# Altium schematic sheet Heart.SchDoc
size A3; SheetNumber: 1; SheetTotal: 1
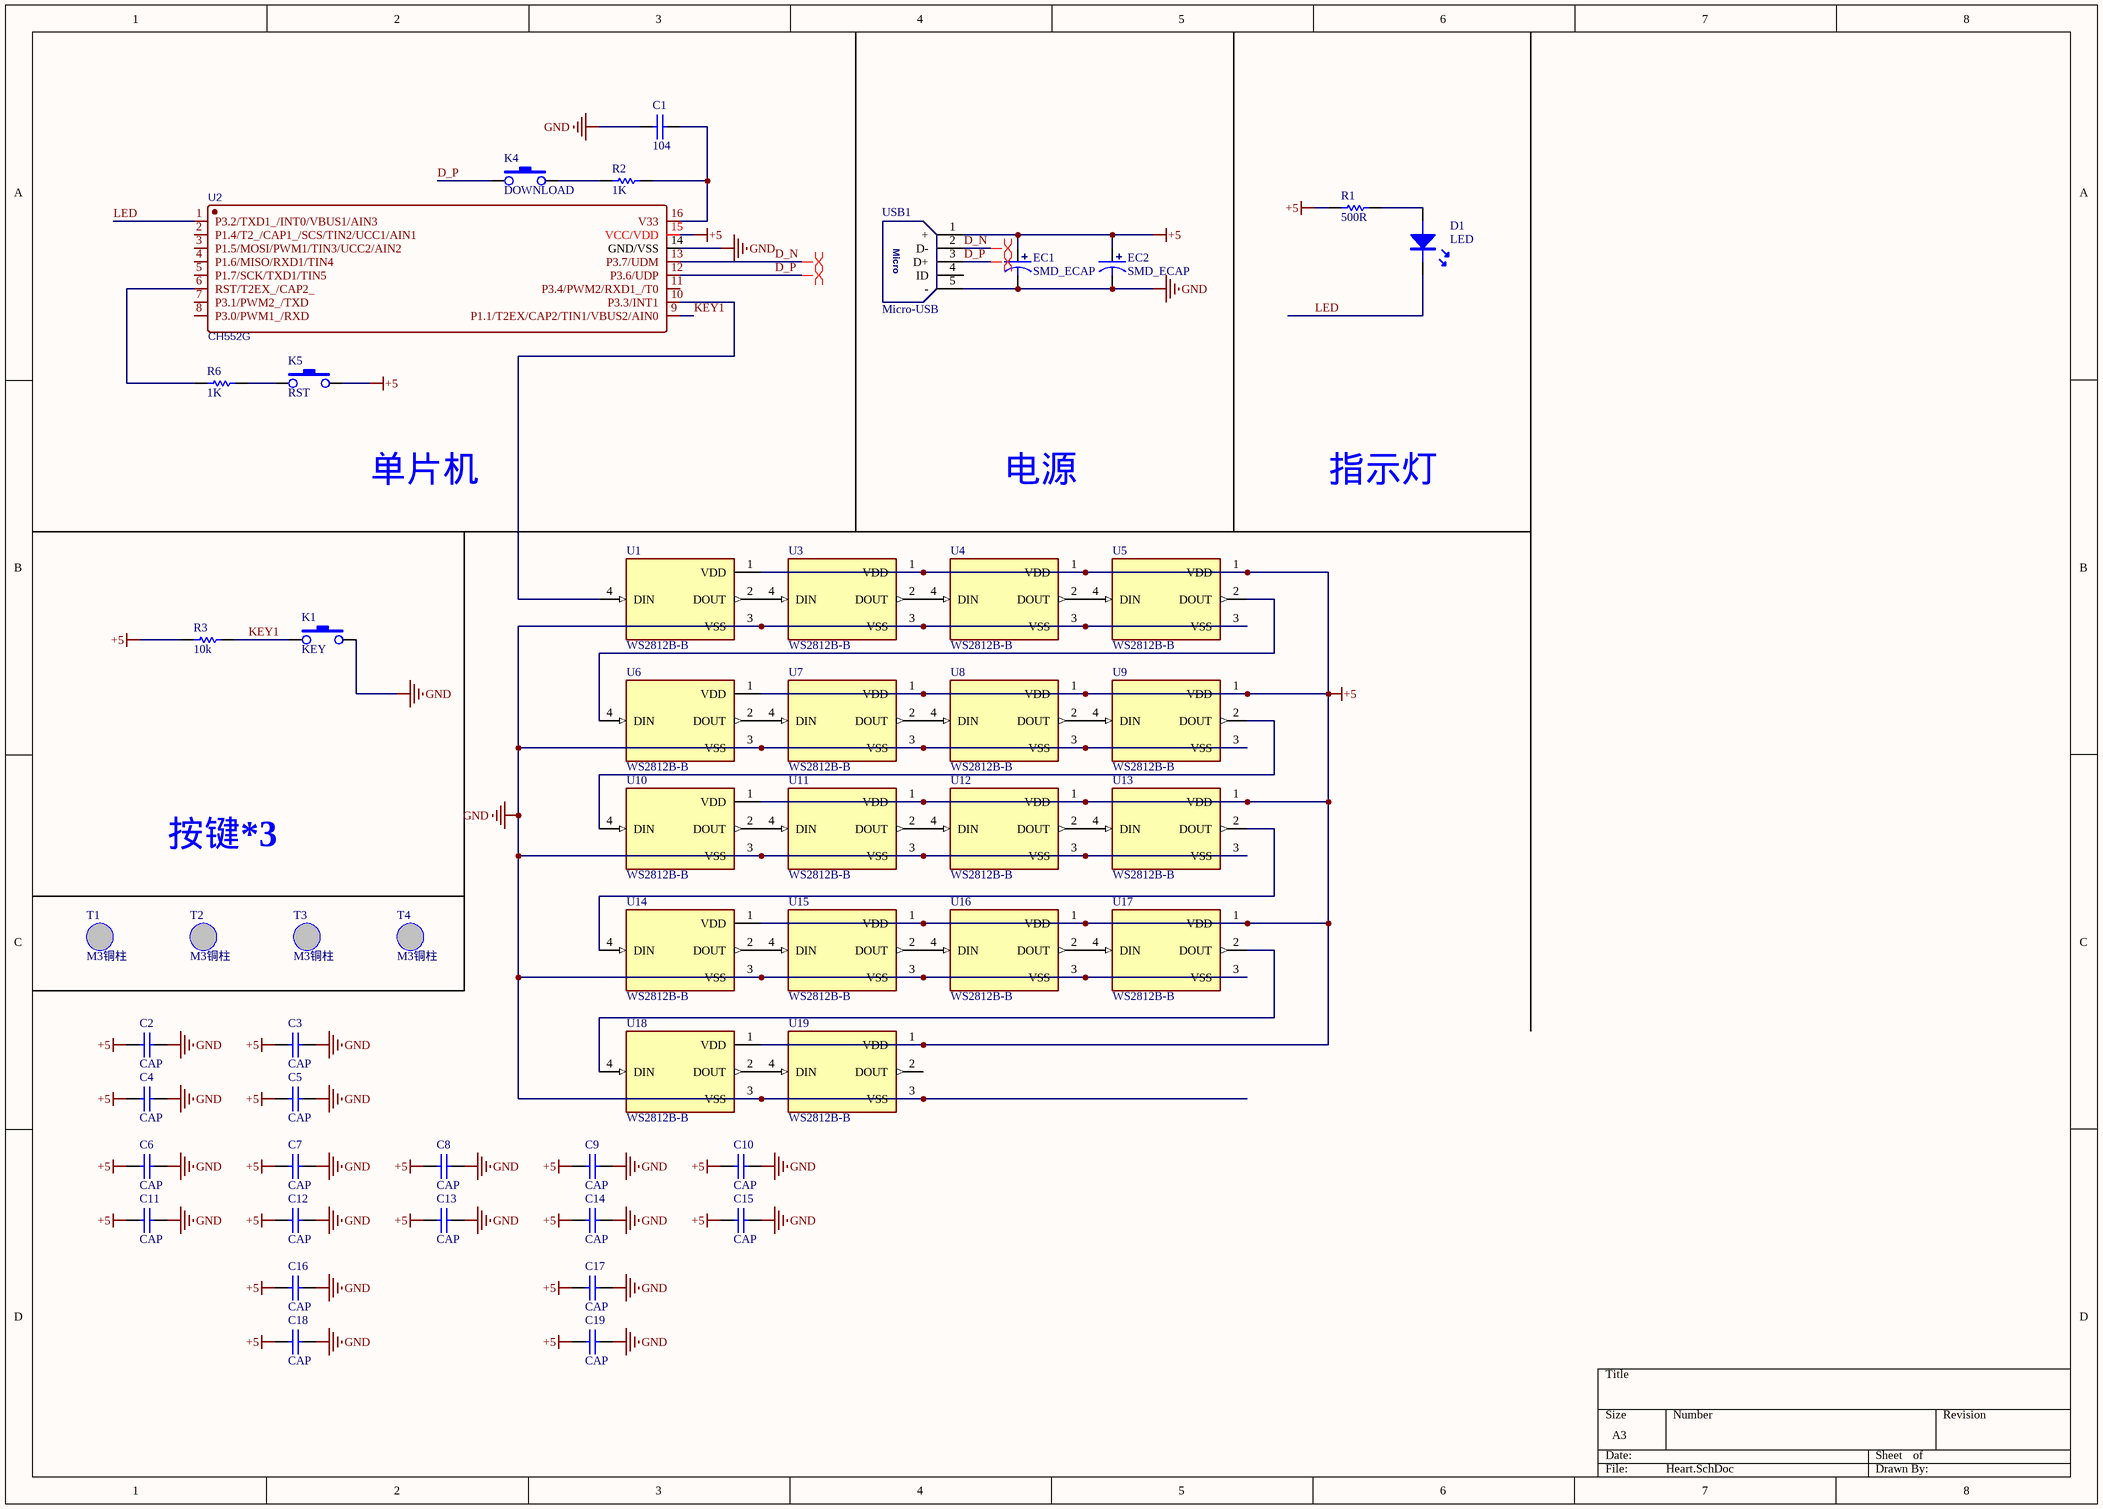
[diagram p0: Heart.SchDoc]

## Parts
C1  104  [0805C]
C2  CAP  [0805C]
C3  CAP  [0805C]
C4  CAP  [0805C]
C5  CAP  [0805C]
C6  CAP  [0805C]
C7  CAP  [0805C]
C8  CAP  [0805C]
C9  CAP  [0805C]
C10  CAP  [0805C]
C11  CAP  [0805C]
C12  CAP  [0805C]
C13  CAP  [0805C]
C14  CAP  [0805C]
C15  CAP  [0805C]
C16  CAP  [0805C]
C17  CAP  [0805C]
C18  CAP  [0805C]
C19  CAP  [0805C]
D1  LED  [LED-0805G]
EC1  SMD_ECAP  [SMD-EC5.0X5.3X5.4]
EC2  SMD_ECAP  [SMD-EC5.0X5.3X5.4]
K1  KEY  [SMD-3X6X5]
K4  DOWNLOAD  [SMD-3X6X5]
K5  RST  [SMD-3X6X5]
R1  500R  [0805R]
R2  1K  [0805R]
R3  10k  [0805R]
R6  1K  [0805R]
T1  M3铜柱  [M3 单孔]
T2  M3铜柱  [M3 单孔]
T3  M3铜柱  [M3 单孔]
T4  M3铜柱  [M3 单孔]
U1  WS2812B-B  [LED_WS2812B-B++]
U2  CH552G  [SOP16]
U3  WS2812B-B  [LED_WS2812B-B++]
U4  WS2812B-B  [LED_WS2812B-B++]
U5  WS2812B-B  [LED_WS2812B-B++]
U6  WS2812B-B  [LED_WS2812B-B++]
U7  WS2812B-B  [LED_WS2812B-B++]
U8  WS2812B-B  [LED_WS2812B-B++]
U9  WS2812B-B  [LED_WS2812B-B++]
U10  WS2812B-B  [LED_WS2812B-B++]
U11  WS2812B-B  [LED_WS2812B-B++]
U12  WS2812B-B  [LED_WS2812B-B++]
U13  WS2812B-B  [LED_WS2812B-B++]
U14  WS2812B-B  [LED_WS2812B-B++]
U15  WS2812B-B  [LED_WS2812B-B++]
U16  WS2812B-B  [LED_WS2812B-B++]
U17  WS2812B-B  [LED_WS2812B-B++]
U18  WS2812B-B  [LED_WS2812B-B++]
U19  WS2812B-B  [LED_WS2812B-B++]
USB1  Micro-USB  [USB-MICRO_A++]

## Nets
+5: C2.1 C3.1 C4.1 C5.1 C6.1 C7.1 C8.1 C9.1 C10.1 C11.1 C12.1 C13.1 C14.1 C15.1 C16.1 C17.1 C18.1 C19.1 EC1.1 EC2.1 K5.3 R1.1 R3.1 U1.1(VDD) U2.15(VCC/VDD) U3.1(VDD) U4.1(VDD) U5.1(VDD) U6.1(VDD) U7.1(VDD) U8.1(VDD) U9.1(VDD) U10.1(VDD) U11.1(VDD) U12.1(VDD) U13.1(VDD) U14.1(VDD) U15.1(VDD) U16.1(VDD) U17.1(VDD) U18.1(VDD) U19.1(VDD) USB1.1(+)
GND: C1.2 C2.2 C3.2 C4.2 C5.2 C6.2 C7.2 C8.2 C9.2 C10.2 C11.2 C12.2 C13.2 C14.2 C15.2 C16.2 C17.2 C18.2 C19.2 EC1.2 EC2.2 K1.3 U1.3(VSS) U2.14(GND/VSS) U3.3(VSS) U4.3(VSS) U5.3(VSS) U6.3(VSS) U7.3(VSS) U8.3(VSS) U9.3(VSS) U10.3(VSS) U11.3(VSS) U12.3(VSS) U13.3(VSS) U14.3(VSS) U15.3(VSS) U16.3(VSS) U17.3(VSS) U18.3(VSS) U19.3(VSS) USB1.5(-)
D_N: U2.13(P3.7/UDM) USB1.2(D-)
D_P: K4.1 U2.12(P3.6/UDP) USB1.3(D+)
KEY1: K1.1 R3.2 U2.9(P1.1/T2EX/CAP2/TIN1/VBUS2/AIN0)
LED: D1.K U2.1(P3.2/TXD1_/INT0/VBUS1/AIN3)
NetC1_1: C1.1 R2.2 U2.16(V33)
NetD1_A: D1.A R1.2
NetK4_3: K4.3 R2.1
NetK5_1: K5.1 R6.1
NetR6_2: R6.2 U2.6(RST/T2EX_/CAP2_)
NetU1_2: U1.2(DOUT) U3.4(DIN)
NetU1_4: U1.4(DIN) U2.10(P3.3/INT1)
NetU3_2: U3.2(DOUT) U4.4(DIN)
NetU4_2: U4.2(DOUT) U5.4(DIN)
NetU5_2: U5.2(DOUT) U6.4(DIN)
NetU6_2: U6.2(DOUT) U7.4(DIN)
NetU7_2: U7.2(DOUT) U8.4(DIN)
NetU8_2: U8.2(DOUT) U9.4(DIN)
NetU9_2: U9.2(DOUT) U10.4(DIN)
NetU10_2: U10.2(DOUT) U11.4(DIN)
NetU11_2: U11.2(DOUT) U12.4(DIN)
NetU12_2: U12.2(DOUT) U13.4(DIN)
NetU13_2: U13.2(DOUT) U14.4(DIN)
NetU14_2: U14.2(DOUT) U15.4(DIN)
NetU15_2: U15.2(DOUT) U16.4(DIN)
NetU16_2: U16.2(DOUT) U17.4(DIN)
NetU17_2: U17.2(DOUT) U18.4(DIN)
NetU18_2: U18.2(DOUT) U19.4(DIN)

Not connected (* = marked no-connect by the designer): U2 2(P1.4/T2_/CAP1_/SCS/TIN2/UCC1/AIN1) 3(P1.5/MOSI/PWM1/TIN3/UCC2/AIN2) 4(P1.6/MISO/RXD1/TIN4) 5(P1.7/SCK/TXD1/TIN5) 7(P3.1/PWM2_/TXD) 8(P3.0/PWM1_/RXD) 11(P3.4/PWM2/RXD1_/T0); U19 2(DOUT); USB1 4(ID)

## Layout directives
differential pair: D_N, D_P

## Notes on the sheet
- 单片机
- 电源
- 指示灯
- 按键*3
- (in symbol Micro-USB) Micro

## Library data of the parts
C1-C19 = CAP: 无极性电容
EC1 EC2 = SMD_ECAP: 贴片电解电容
K4 K5 = KEY
R1-R3 R6 = RES
U1 U3-U19 = WS2812B-B: Intelligent control LED integrated light source; MF: {'manufacturer': u'Worldsemi'}; MP: WS2812B-B; Price: None; Package: None; Availability: Unavailable; Value: *
U2 = CH552G: BOM_Manufacturer: WCH; SMT Type: Extend; BOM_Supplier: LCSC; BOM_Manufacturer Part: CH552G; BOM_Supplier Part: C111292; BOM_JLCPCB SMD: Yes; spicePre: U; spiceSymbolName: CH552G